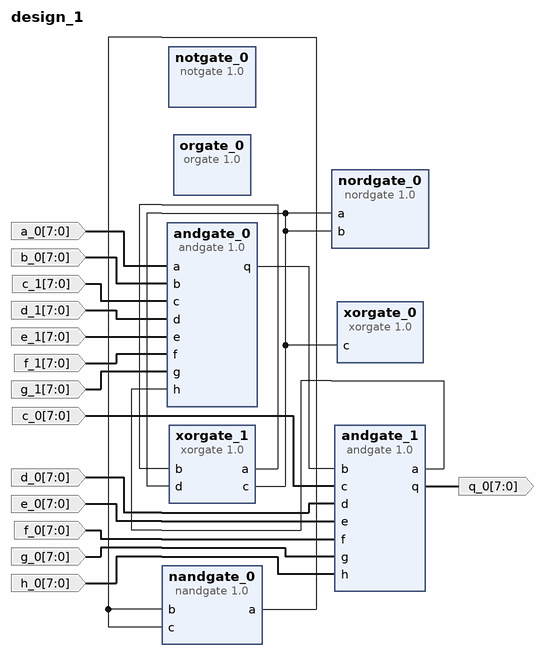
[diagram p0: block diagram of the top level]
# Vivado block design design_1, xc7a100tfgg484-1, Vivado 2017.4
create_bd_design design_1

create_bd_port -dir I -from 7 -to 0 c_0
create_bd_port -dir I -from 7 -to 0 d_0
create_bd_port -dir I -from 7 -to 0 e_0
create_bd_port -dir I -from 7 -to 0 f_0
create_bd_port -dir I -from 7 -to 0 g_0
create_bd_port -dir I -from 7 -to 0 h_0
create_bd_port -dir O -from 7 -to 0 q_0
create_bd_port -dir I -from 7 -to 0 a_0
create_bd_port -dir I -from 7 -to 0 b_0
create_bd_port -dir I -from 7 -to 0 c_1
create_bd_port -dir I -from 7 -to 0 d_1
create_bd_port -dir I -from 7 -to 0 e_1
create_bd_port -dir I -from 7 -to 0 f_1
create_bd_port -dir I -from 7 -to 0 g_1

create_bd_cell -type ip -vlnv xilinx.com:user:andgate:1.0 andgate_0
create_bd_cell -type ip -vlnv xilinx.com:user:andgate:1.0 andgate_1
create_bd_cell -type ip -vlnv xilinx.com:user:notgate:1.0 notgate_0
create_bd_cell -type ip -vlnv xilinx.com:user:orgate:1.0 orgate_0
create_bd_cell -type ip -vlnv xilinx.com:user:nandgate:1.0 nandgate_0
create_bd_cell -type ip -vlnv xilinx.com:user:nordgate:1.0 nordgate_0
create_bd_cell -type ip -vlnv xilinx.com:user:xorgate:1.0 xorgate_0
create_bd_cell -type ip -vlnv xilinx.com:user:xorgate:1.0 xorgate_1

# ---- connections ----

connect_bd_net [get_bd_pins andgate_1/a] [get_bd_pins andgate_0/h]
connect_bd_net [get_bd_pins andgate_0/q] [get_bd_pins andgate_1/b]
connect_bd_net -net c_0_1 [get_bd_ports c_0] [get_bd_pins andgate_1/c]
connect_bd_net -net d_0_1 [get_bd_ports d_0] [get_bd_pins andgate_1/d]
connect_bd_net -net e_0_1 [get_bd_ports e_0] [get_bd_pins andgate_1/e]
connect_bd_net -net f_0_1 [get_bd_ports f_0] [get_bd_pins andgate_1/f]
connect_bd_net -net g_0_1 [get_bd_ports g_0] [get_bd_pins andgate_1/g]
connect_bd_net -net h_0_1 [get_bd_ports h_0] [get_bd_pins andgate_1/h]
connect_bd_net [get_bd_pins andgate_1/q] [get_bd_ports q_0]
connect_bd_net -net a_0_1 [get_bd_ports a_0] [get_bd_pins andgate_0/a]
connect_bd_net -net b_0_1 [get_bd_ports b_0] [get_bd_pins andgate_0/b]
connect_bd_net -net c_1_1 [get_bd_ports c_1] [get_bd_pins andgate_0/c]
connect_bd_net -net d_1_1 [get_bd_ports d_1] [get_bd_pins andgate_0/d]
connect_bd_net -net e_1_1 [get_bd_ports e_1] [get_bd_pins andgate_0/e]
connect_bd_net -net f_1_1 [get_bd_ports f_1] [get_bd_pins andgate_0/f]
connect_bd_net -net g_1_1 [get_bd_ports g_1] [get_bd_pins andgate_0/g]
connect_bd_net [get_bd_pins nandgate_0/a] [get_bd_pins nandgate_0/b] [get_bd_pins nandgate_0/c]
connect_bd_net [get_bd_pins xorgate_1/a] [get_bd_pins xorgate_1/b]
connect_bd_net [get_bd_pins xorgate_1/c] [get_bd_pins xorgate_1/d] [get_bd_pins xorgate_0/c] [get_bd_pins nordgate_0/a] [get_bd_pins nordgate_0/b]

validate_bd_design
save_bd_design
